# Altium schematic sheet 01_main.SchDoc
size C; CompanyName: Signal Laboratories, Inc.; Address1: 3479 Edison Way; Address2: Menlo Park CA 94025; Address3: +1 (877) 778-8435; Address4: siglabs.com; Revision: 1; SheetNumber: 1; SheetTotal: 1
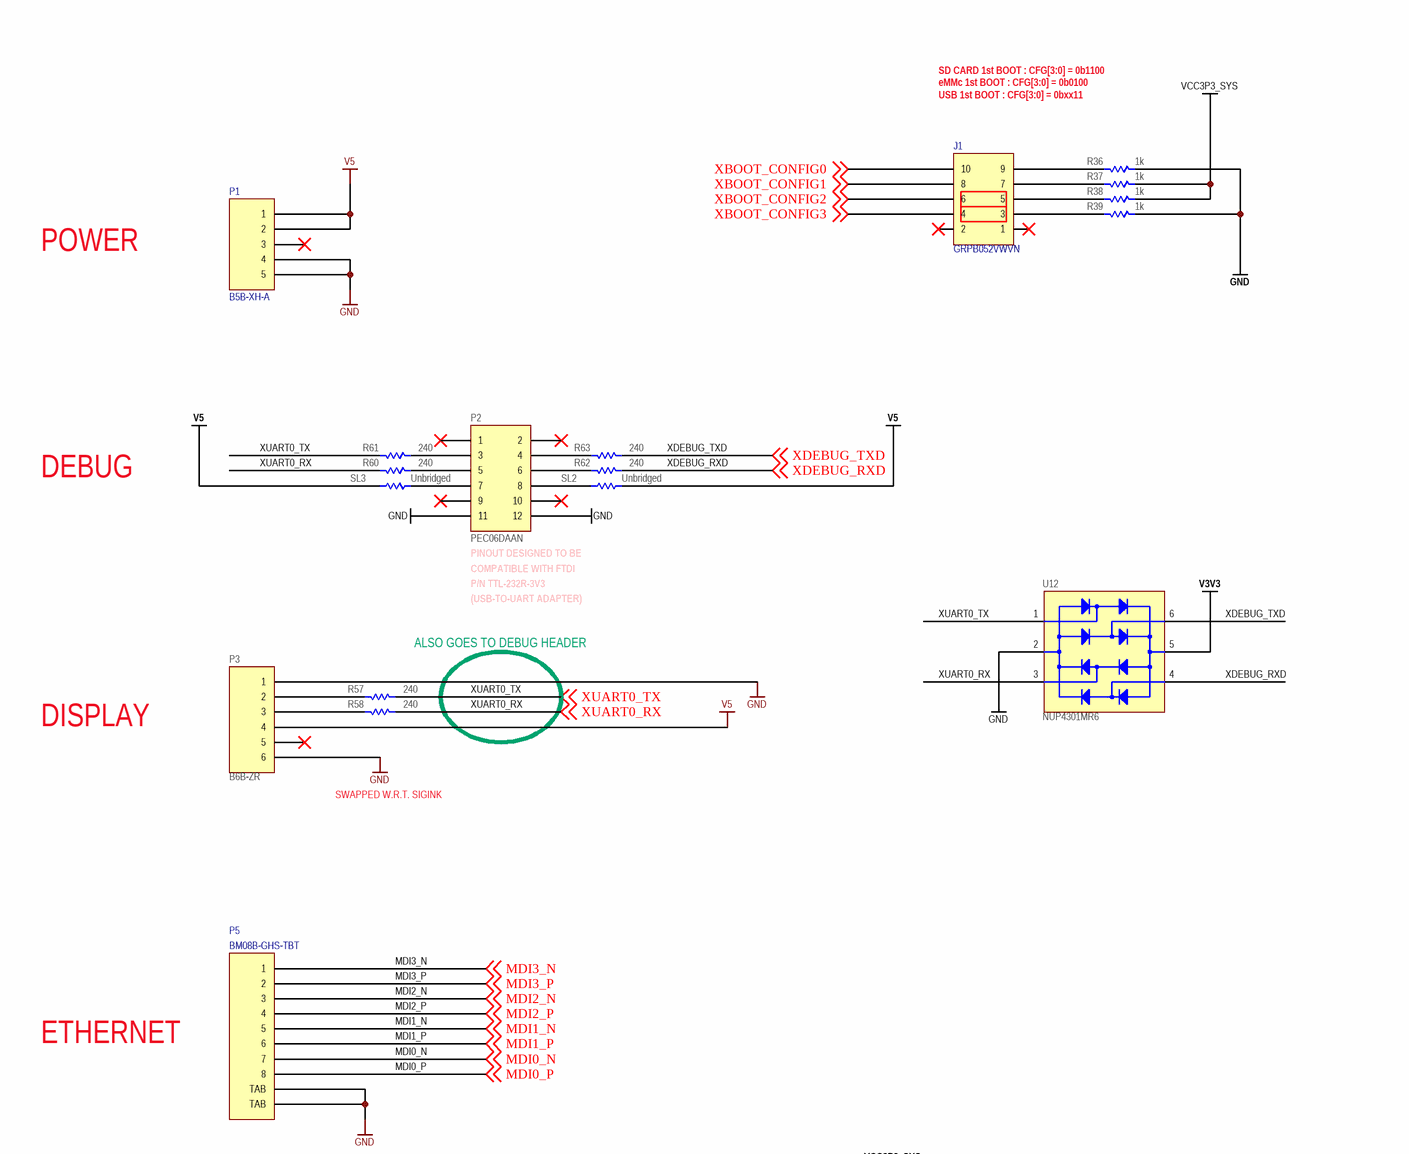
[diagram p0: 01_main.SchDoc, top left]
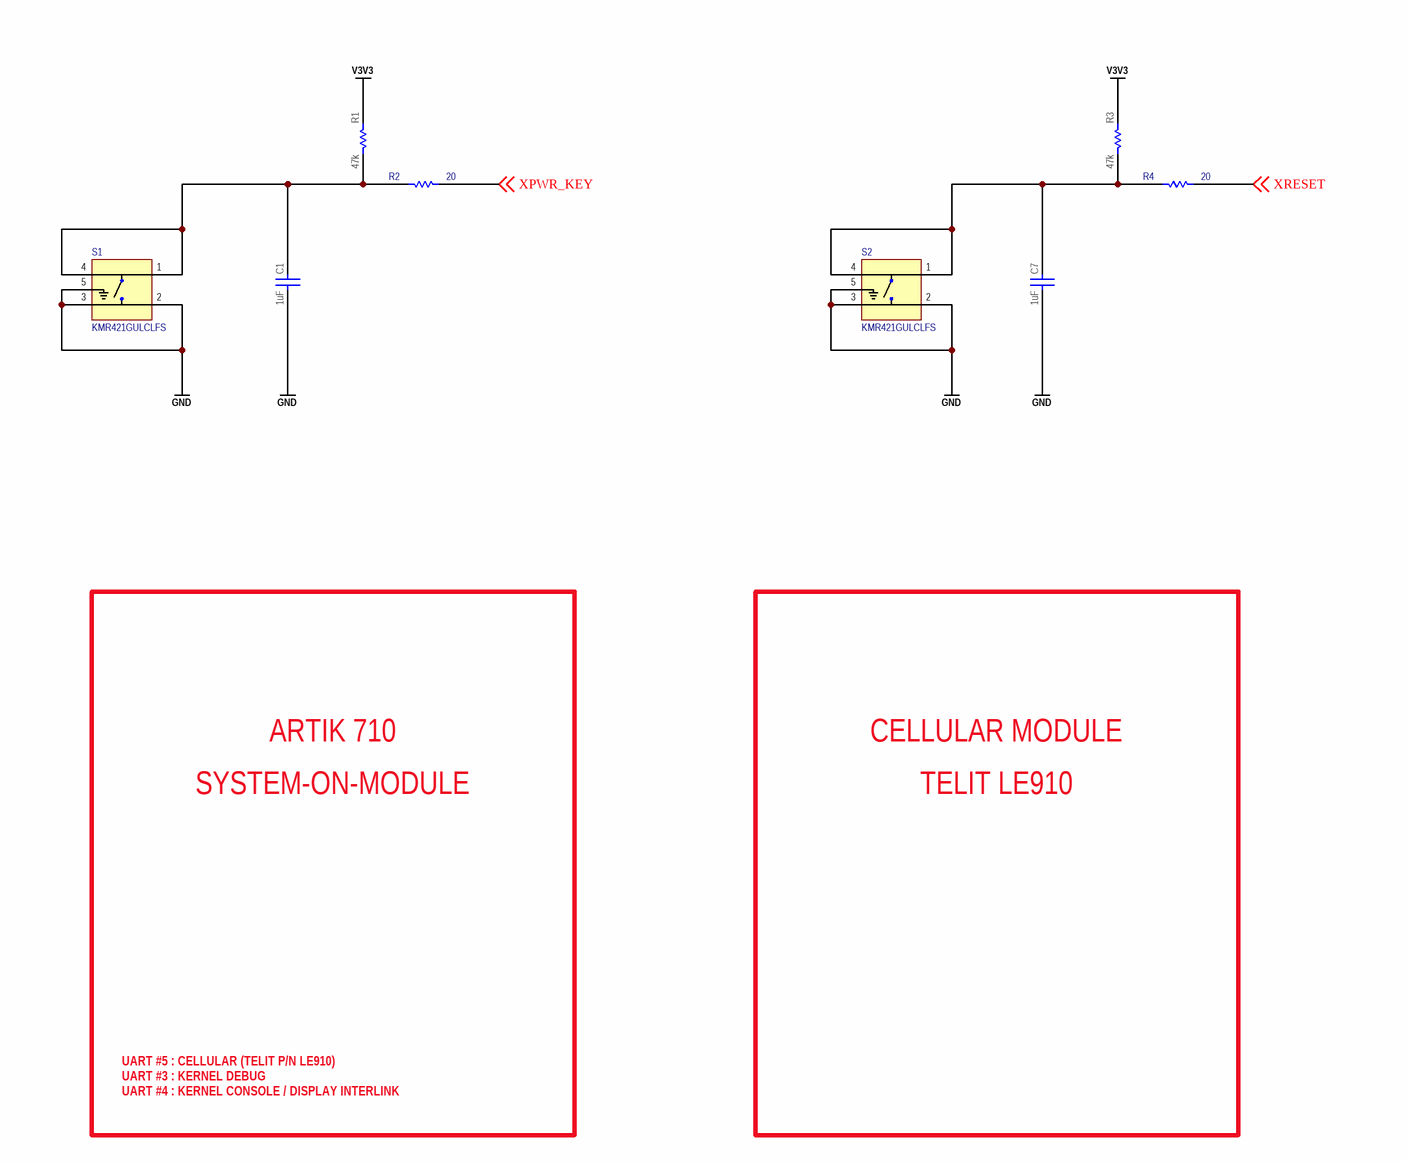
[diagram p1: 01_main.SchDoc, top right]
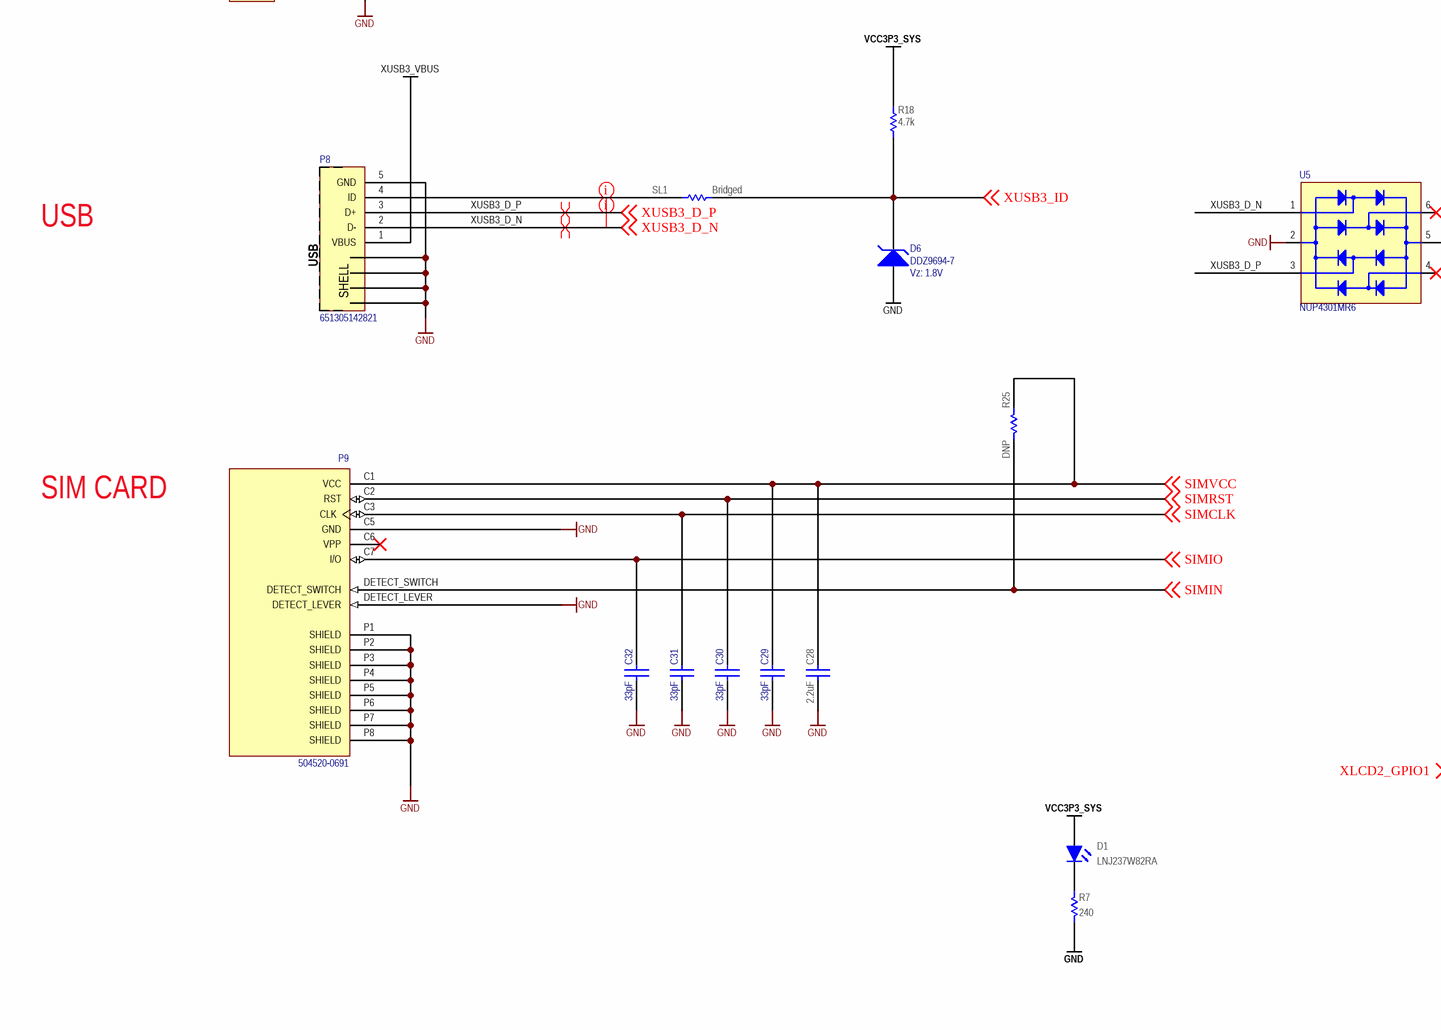
[diagram p2: 01_main.SchDoc, bottom left]
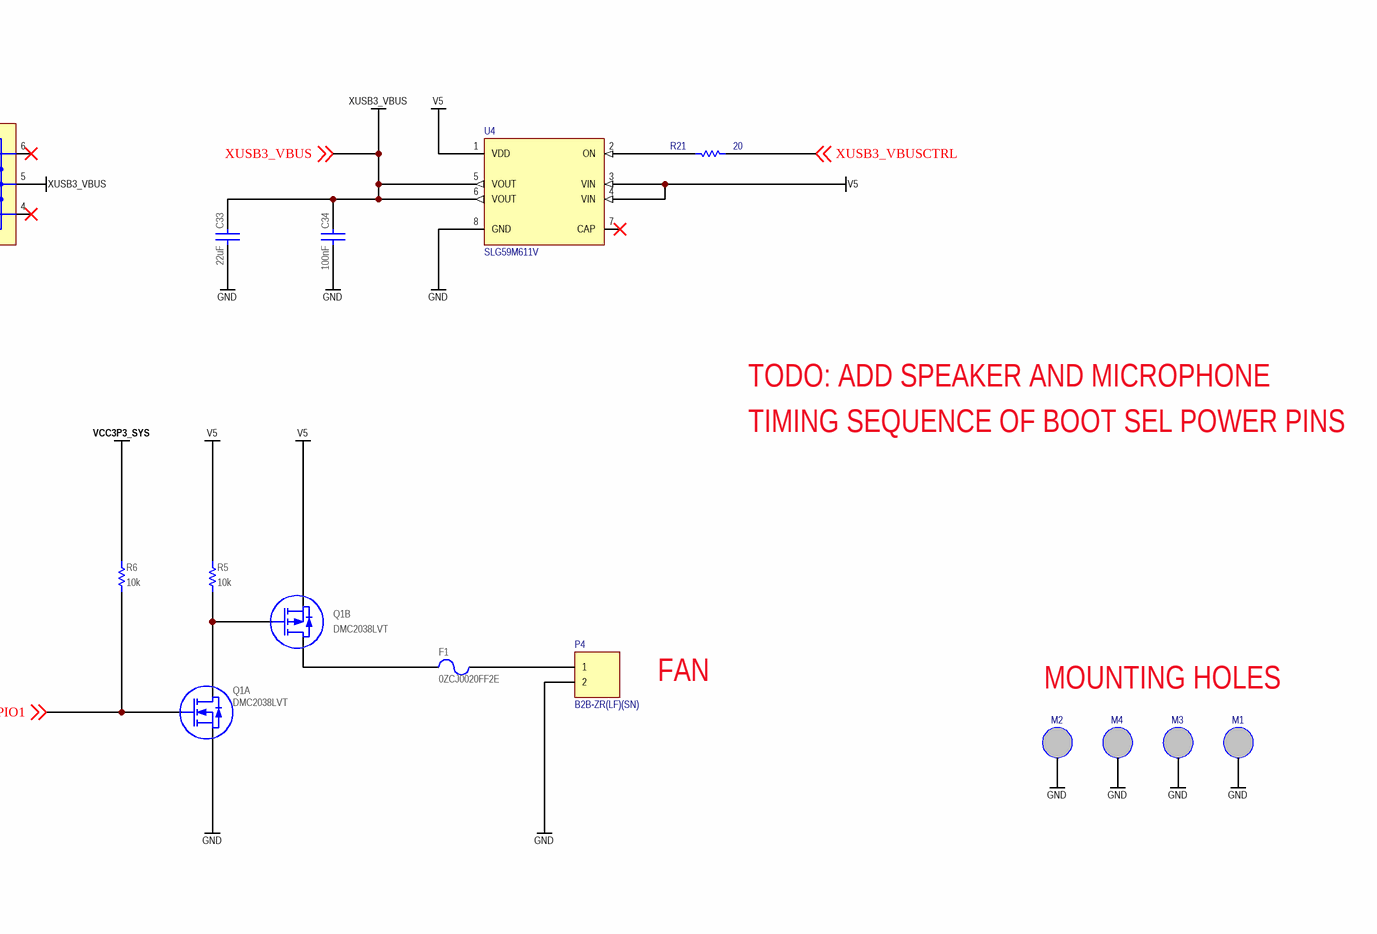
[diagram p3: 01_main.SchDoc, bottom right]

## Parts
C1  value 1uF  [CAPC160X80X90L20N]  (hidden comment: C1608X7R1A105M080)
C7  value 1uF  [CAPC160X80X90L20N]  (hidden comment: C1608X7R1A105M080)
C28  value 2.2uF  [CAPC160X80X90L20N]  (hidden comment: C1608X7R1A225M080)
C29  value 33pF  [0402]  (hidden comment: CBR04C330F5GAC)
C30  value 33pF  [0402]  (hidden comment: CBR04C330F5GAC)
C31  value 33pF  [0402]  (hidden comment: CBR04C330F5GAC)
C32  value 33pF  [0402]  (hidden comment: CBR04C330F5GAC)
C33  value 22uF  [CAPC200X125X145L45N]  (hidden comment: C2012X7S1A226M125)
C34  value 100nF  [CAPC100X50X55L25N]  (hidden comment: GCM155R71H104KE02)
D1  LNJ237W82RA  [0603_LED]
D6  DDZ9694-7  Vz: 1.8V  [SOD123]
F1  0ZCJ0020FF2E  [1206]
J1  GRPB052VWVN  [GRPB052VWVN]
M1  MOUNT350  [mount350]  (value not drawn)  (no BOM)
M2  MOUNT350  [mount350]  (value not drawn)  (no BOM)
M3  MOUNT350  [mount350]  (value not drawn)  (no BOM)
M4  MOUNT350  [mount350]  (value not drawn)  (no BOM)
P1  B5B-XH-A  [B5B-XH-A]
P2  PEC06DAAN  [HDR2X6]
P3  B6B-ZR  [B6B-ZR]
P4  B2B-ZR(LF)(SN)  [B2B-ZR]
P5  BM08B-GHS-TBT  [BM08B-GHS-TBT]
P8  651305142821  [651305142821]
P9  504520-0691  [504520-0691]
Q1  DMC2038LVT  [TSOP-6]  (parts A,B of 2)
R1  value 47k  [RESC1005X40N]  (hidden comment: ERJ-2RKF4702X)
R2  value 20  [0402]  (hidden comment: ERJ-2RKF20R0X)
R3  value 47k  [RESC1005X40N]  (hidden comment: ERJ-2RKF4702X)
R4  value 20  [0402]  (hidden comment: ERJ-2RKF20R0X)
R5  value 10k  [RESC1005X40N]  (hidden comment: ERJ-2RKF1002X)
R6  value 10k  [RESC1005X40N]  (hidden comment: ERJ-2RKF1002X)
R7  value 240  [RESC1005X40N]  (hidden comment: ERJ-2RKF2400X)
R18  value 4.7k  [RESC1005X40N]  (hidden comment: ERJ-2RKF4701X)
R21  value 20  [0402]  (hidden comment: ERJ-2RKF20R0X)
R25  Do Not Place: DNP  [RESC1005X40N]  (hidden comment: ERJ-2RKF4702X)
R36  value 1k  [RESC1005X40N]  (hidden comment: ERJ-2RKF1001X)
R37  value 1k  [RESC1005X40N]  (hidden comment: ERJ-2RKF1001X)
R38  value 1k  [RESC1005X40N]  (hidden comment: ERJ-2RKF1001X)
R39  value 1k  [RESC1005X40N]  (hidden comment: ERJ-2RKF1001X)
R57  value 240  [RESC1005X40N]  (hidden comment: ERJ-2RKF2400X)
R58  value 240  [RESC1005X40N]  (hidden comment: ERJ-2RKF2400X)
R60  value 240  [RESC1005X40N]  (hidden comment: ERJ-2RKF2400X)
R61  value 240  [RESC1005X40N]  (hidden comment: ERJ-2RKF2400X)
R62  value 240  [RESC1005X40N]  (hidden comment: ERJ-2RKF2400X)
R63  value 240  [RESC1005X40N]  (hidden comment: ERJ-2RKF2400X)
S1  KMR421GULCLFS  [SW_KMR421GULCLFS]
S2  KMR421GULCLFS  [SW_KMR421GULCLFS]
SL1  value Bridged  [SOLDERLINK0603X26N_BRIDGED]  (hidden comment: SOLDER_LINK_BRIDGED)  (no BOM)
SL2  value Unbridged  [SOLDERLINK0603X26N]  (hidden comment: SOLDER_LINK)  (no BOM)
SL3  value Unbridged  [SOLDERLINK0603X26N]  (hidden comment: SOLDER_LINK)  (no BOM)
U4  SLG59M611V  [DFN200X150X80-8N]
U5  NUP4301MR6  [SOT23-6]
U12  NUP4301MR6  [SOT23-6]

## Nets
GND: C1.1 C7.1 C28.1 C29.2 C30.2 C31.2 C32.2 C33.1 C34.1 D6.1(A) M1.1(GND) M2.1(GND) M3.1(GND) M4.1(GND) P1.4 P1.5 P2.11 P2.12 P3.1 P3.6 P4.2 P5.9(TAB) P5.10(TAB) P8.5(GND) P8.SHELL(SHIELD) P8.SHELL1(SHIELD) P8.SHELL2(SHIELD) P8.SHELL3(SHIELD) P9.C5(GND) P9.DETECT_LEVER P9.P1(SHIELD) P9.P2(SHIELD) P9.P3(SHIELD) P9.P4(SHIELD) P9.P5(SHIELD) P9.P6(SHIELD) P9.P7(SHIELD) P9.P8(SHIELD) Q1.5(S) R7.2 R36.2 R39.2 S1.2 S1.3 S1.5(G) S2.2 S2.3 S2.5(G) U4.8(GND) U5.2(VN) U12.2(VN)
V3V3: R1.2 R3.2 U12.5(VP)
V5: P1.1 P1.2 P3.4 Q1.2(S) R5.2 SL2.2 SL3.1 U4.1(VDD) U4.3(VIN) U4.4(VIN)
VCC3P3_SYS: D1.1(A) R6.2 R18.2 R37.2 R38.2
XUSB3_VBUS: C33.2 C34.2 P8.1(VBUS) U4.5(VOUT) U4.6(VOUT) U5.5(VP) ; off-sheet XUSB3_VBUS
MDI0_N: P5.7 ; off-sheet MDI0_N
MDI0_P: P5.8 ; off-sheet MDI0_P
MDI1_N: P5.5 ; off-sheet MDI1_N
MDI1_P: P5.6 ; off-sheet MDI1_P
MDI2_N: P5.3 ; off-sheet MDI2_N
MDI2_P: P5.4 ; off-sheet MDI2_P
MDI3_N: P5.1 ; off-sheet MDI3_N
MDI3_P: P5.2 ; off-sheet MDI3_P
SIMCLK: C31.1 P9.C3(CLK) ; off-sheet SIMCLK
SIMIN: P9.DETECT_SWITCH R25.1 ; off-sheet SIMIN
SIMIO: C32.1 P9.C7(I/O) ; off-sheet SIMIO
SIMRST: C30.1 P9.C2(RST) ; off-sheet SIMRST
SIMVCC: C28.2 C29.1 P9.C1(VCC) R25.2 ; off-sheet SIMVCC
XBOOT_CONFIG0: J1.10 ; off-sheet XBOOT_CONFIG0
XBOOT_CONFIG1: J1.8 ; off-sheet XBOOT_CONFIG1
XBOOT_CONFIG2: J1.6 ; off-sheet XBOOT_CONFIG2
XBOOT_CONFIG3: J1.4 ; off-sheet XBOOT_CONFIG3
XDEBUG_RXD: R62.2 U12.4(C) ; off-sheet XDEBUG_RXD
XDEBUG_TXD: R63.2 U12.6(D) ; off-sheet XDEBUG_TXD
XLCD2_GPIO1: Q1.1(G) R6.1 ; off-sheet XLCD2_GPIO1
XPWR_KEY: R2.2 ; off-sheet XPWR_KEY
XRESET: R4.2 ; off-sheet XRESET
XUART0_RX: R58.2 R60.1 U12.3(B) ; off-sheet XUART0_RX
XUART0_TX: R57.2 R61.1 U12.1(A) ; off-sheet XUART0_TX
XUSB3_D_N: P8.2(D-) U5.1(A) ; off-sheet XUSB3_D_N
XUSB3_D_P: P8.3(D+) U5.3(B) ; off-sheet XUSB3_D_P
XUSB3_ID: D6.2(C) R18.1 SL1.2 ; off-sheet XUSB3_ID
XUSB3_VBUSCTRL: R21.2 ; off-sheet XUSB3_VBUSCTRL
NetC1_2: C1.2 R1.1 R2.1 S1.1 S1.4
NetC7_2: C7.2 R3.1 R4.1 S2.1 S2.4
NetD1_2: D1.2(K) R7.1
NetF1_1: F1.1 Q1.4(D)
NetF1_2: F1.2 P4.1
NetJ1_3: J1.3 R39.1
NetJ1_5: J1.5 R38.1
NetJ1_7: J1.7 R37.1
NetJ1_9: J1.9 R36.1
NetP2_3: P2.3 R61.2
NetP2_4: P2.4 R63.1
NetP2_5: P2.5 R60.2
NetP2_6: P2.6 R62.1
NetP2_7: P2.7 SL3.2
NetP2_8: P2.8 SL2.1
NetP3_2: P3.2 R57.1
NetP3_3: P3.3 R58.1
NetP8_4: P8.4(ID) SL1.1
NetQ1_3: Q1.3(G) Q1.6(D) R5.1
NetR21_1: R21.1 U4.2(ON)

Not connected (* = marked no-connect by the designer): J1 1* 2*; P1 3*; P2 1* 2* 9* 10*; P3 5*; P9 C6(VPP)*; U4 7(CAP)*; U5 4(C)* 6(D)*

## Layout directives
net class USB: XUSB3_D_N, XUSB3_D_P
differential pair: XUSB3_D_N, XUSB3_D_P

## Notes on the sheet
- SD CARD 1st BOOT : CFG[3:0] = 0b1100
  eMMc 1st BOOT : CFG[3:0] = 0b0100
  USB 1st BOOT : CFG[3:0] = 0bxx11
- POWER
- DEBUG
- (near P2) PINOUT DESIGNED TO BE
- (near P2) COMPATIBLE WITH FTDI
- P/N TTL-232R-3V3
- (USB-TO-UART ADAPTER)
- ALSO GOES TO DEBUG HEADER
- DISPLAY
- ARTIK 710
- CELLULAR MODULE
- SWAPPED W.R.T. SIGINK
- SYSTEM-ON-MODULE
- TELIT LE910
- ETHERNET
- UART #5 : CELLULAR (TELIT P/N LE910)
  UART #3 : KERNEL DEBUG
  UART #4 : KERNEL CONSOLE / DISPLAY INTERLINK
- USB
- TODO: ADD SPEAKER AND MICROPHONE
- SIM CARD
- TIMING SEQUENCE OF BOOT SEL POWER PINS
- FAN
- MOUNTING HOLES
- Title
- Engineer
- Revision
- Drawn By
- Sheet
- of
- Checked By
- Date
- (in symbol 651305142821) USB

## Library data of the parts
C1 C7 = CAP: Ceramic Capacitor 1uF ±20% 10V X7R 0603; Manufacturer: TDK; Tr: -55:125; Manufacturer P/N: C1608X7R1A105M080; Tolerance: ±20%; Voltage: 10V; Footprint: *; Package: 0603
C28 = CAP: Ceramic Capacitor 2.2uF ±20% 10V X7R 0603; Manufacturer: TDK; Tr: -55:125; Manufacturer P/N: C1608X7R1A225M080; Tolerance: ±20%; Voltage: 10V; Footprint: *; Package: 0603
C29-C32 = CAP 0603: Ceramic Capacitor 33pF ±1% 50V NP0 0402; Manufacturer: Kemet; Tr: -55:125; Voltage: 50V; Manufacturer P/N: CBR04C330F5GAC; Package: 0402; Do Not Place: *; Tolerance: ±1%
C33 = CAP: Ceramic Capacitor 22uF ±20% 10V X7S 0805; Manufacturer: TDK; Tr: -55:125; Manufacturer P/N: C2012X7S1A226M125; Tolerance: ±20%; Voltage: 10V; Package: 0805
C34 = CAP: Ceramic Capacitor 100nF ±10% 50V X7R 0402; Manufacturer: Murata; Tr: -55:125; Manufacturer P/N: GCM155R71H104KE02; Tolerance: ±10%; Voltage: 50V; Footprint: *; Package: 0402
D1 = LED0603RD: LED, SMT 0603, Color Red, 5mA, 1.85V; Manufacturer: Panasonic; Manufacturer P/N: LNJ237W82RA; Package: 0603 Polarized
D6 = DDZ9694-7: Zener Diode 1.8V 500mW SOD123; Manufacturer P/N: DDZ9678-7; Manufacturer: Diodes, Inc.
F1 = 0ZCJ0020FF2E: PTC Resettable Fuse, 0.2A, 30V, SMD 1206; Manufacturer: Bell Fuse; Manufacturer P/N: 0ZCJ0020FF2E
J1 = GRPB052VWVN: Male Header, 0.050" Pitch, 2x5 Position; Manufacturer: Sullins; Manufacturer P/N: GRPB052VWVN
M1-M4 = M3_HOLE
P1 = B5B-XH-A: 2.5mm pitch 5-position; Manufacturer: JST; Manufacturer P/N: B5B-XH-A
P2 = Header 6X2H: Header, 6-Pin, Dual row; Manufacturer: Sullins; Manufacturer P/N: PEC06DAAN
P3 = TBD: Header, 6-Pin, Single row, Vertical; Manufacturer: JST; Manufacturer P/N: B6B-ZR
P4 = Header 2: Header, 2-Pin; Manufacturer: JST; Manufacturer P/N: B2B-ZR(LF)(SN)
P5 = BM08B-GHS-TBT: Top Entry Shrouded Connector; 8-position; Manufacturer: JST; Manufacturer P/N: BM08B-GHS-TBT
P8 = 651305142821: Right Angle SMT USB Type-AB Connector Receptacle; Manufacturer: Wurth Elektronik; Manufacturer P/N: 651305142821
P9 = 504520-0691: micro-SIM Card Connector; Manufacturer: Molex; Availability: Good; Package: None; Manufacturer P/N: 504520-0691; Price: 1.31 USD; Value: *
Q1 = DMC2038LVT: Complementary MOSFET Pair; Manufacturer: Diodes, Inc.; Manufacturer P/N: DMC2038LVT
R1 R3 R25 = RES: Thick Film Resistor 47k ±1% 0.1W 75V 0402; Manufacturer: Panasonic; Tcr: ±100; Tr: -55:155; Voltage: 75; Power: 0.1; Tolerance: ±1%; Manufacturer P/N: ERJ-2RKF4702X; Alternatives: *; Footprint: *; Package: 0402
  R25: Value: 47k
R2 R4 R21 = RES 0402: Thick Film Resistor 20 ±1% 0402; Manufacturer: Panasonic; Manufacturer P/N: RC0402FR-0720L; Tr: -55:155; Package: 0402; Tolerance: ±1%
R5 R6 = RES: Thick Film Resistor 10k ±1% 0.1W 0402; Manufacturer: Panasonic; Tcr: ±100; Tr: -55:155; Voltage: 50; Power: 0.1; Manufacturer P/N: ERJ-2RKF1002X; Tolerance: ±1%; Alternatives: *; Footprint: *; Package: 0402
R7 R57 R58 R60-R63 = RES: Thick Film Resistor 240 ±1% 0.1W 75V 0402; Manufacturer: Panasonic; Tcr: ±100; Tr: -55:155; Voltage: 75; Power: 0.1; Tolerance: ±1%; Manufacturer P/N: ERJ-2RKF2400X; Alternatives: *; Footprint: *; Package: 0402
R18 = RES: Thick Film Resistor 4.7k ±1% 0.1W 75V 0402; Manufacturer: Panasonic; Tcr: ±100; Tr: -55:155; Voltage: 75; Power: 0.1; Tolerance: ±1%; Manufacturer P/N: ERJ-2RKF4701X; Alternatives: *; Footprint: *; Package: 0402
R36-R39 = RES: Thick Film Resistor 1k ±1% 0.1W 0402; Manufacturer: Panasonic; Tcr: ±100; Tr: -55:155; Voltage: 75; Power: 0.1; Tolerance: ±1%; Manufacturer P/N: ERJ-2RKF1001X; Alternatives: *; Footprint: *; Package: 0402
S1 S2 = KMR421GULCLFS: Switch Tactile N.O. SPST Round Button Gull Wing 0.05A 32VDC 1VA 200000Cycles 2N SMD Automotive T/R; Manufacturer: C&K Components; Availability: Good; Package: None; Manufacturer P/N: KMR421GULCLFS; Price: 0.29 USD; Value: *
SL1 = RES: Solder Link Bridged; Manufacturer P/N: *; Manufacturer: *
SL2 SL3 = RES: Solder Link Unbridged; Manufacturer P/N: *; Manufacturer: *
U4 = SLG59M611V: High-Side Load Switch; Manufacturer: Silego; Package: WFDFN-8 Silego; Manufacturer P/N: SLG59M611V
U5 U12 = NUP4301MR6: 4-Lane TVS Diode Array; Manufacturer: On Semiconductor; Manufacturer P/N: NUP4301MR6